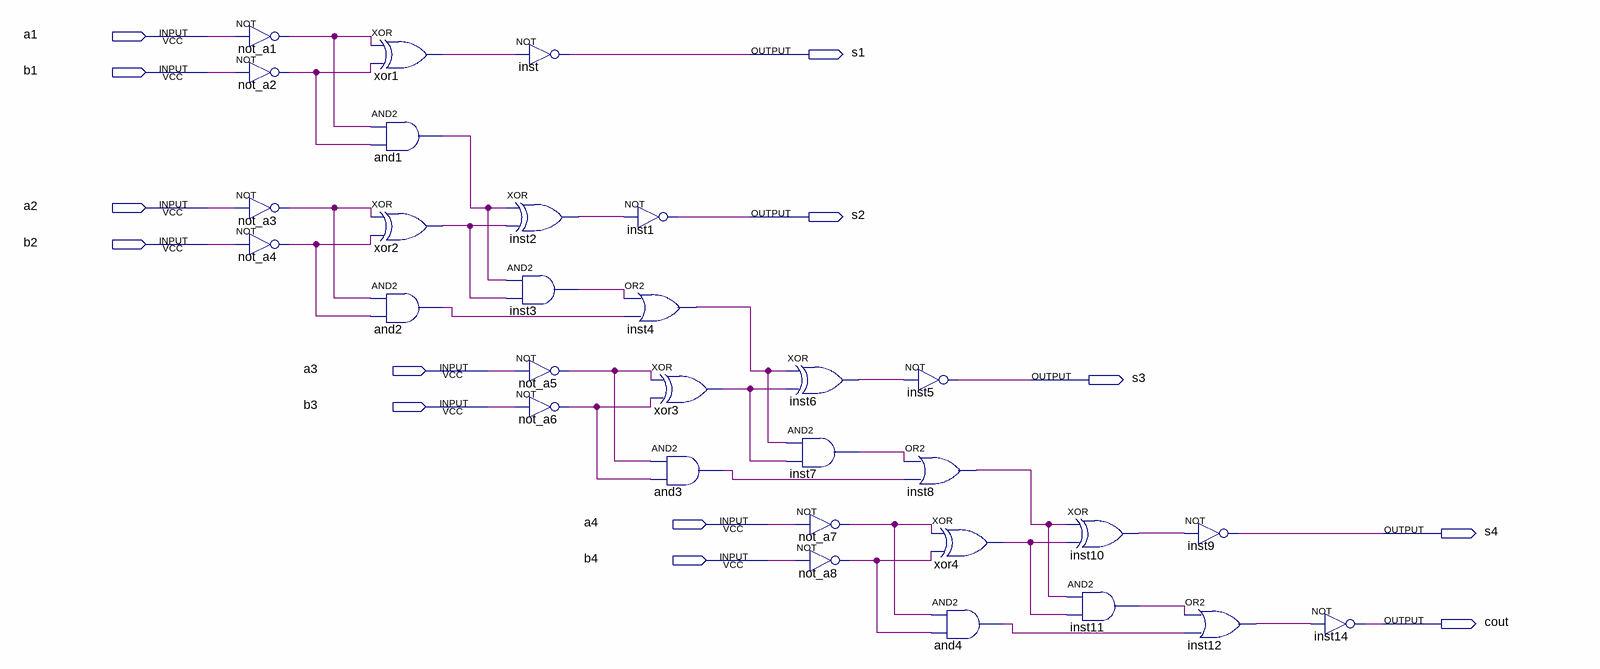
[diagram p0: schematic sheet]
// Quartus schematic lab5.bdf as structural Verilog: 30 symbols, 13 pins
module lab5 (
  input  a1,
  input  b1,
  input  a2,
  input  b2,
  input  a3,
  input  b3,
  input  a4,
  input  b4,
  output s1,
  output s2,
  output s3,
  output s4,
  output cout
);

  wire and1_out, and2_out, and3_out, and4_out, inst2_out, inst3_out, inst4_out, inst6_out, inst7_out,
       inst8_out, inst10_out, inst11_out, inst12_out, not_a1_out, not_a2_out, not_a3_out, not_a4_out,
       not_a5_out, not_a6_out, not_a7_out, not_a8_out, xor1_out, xor2_out, xor3_out, xor4_out;

  not not_a1 (not_a1_out, a1);
  not not_a2 (not_a2_out, b1);
  not not_a3 (not_a3_out, a2);
  not not_a4 (not_a4_out, b2);
  xor xor1 (xor1_out, not_a1_out, not_a2_out);
  and and1 (and1_out, not_a1_out, not_a2_out);
  xor xor2 (xor2_out, not_a3_out, not_a4_out);
  and and2 (and2_out, not_a3_out, not_a4_out);
  not inst (s1, xor1_out);
  xor inst2 (inst2_out, and1_out, xor2_out);
  and inst3 (inst3_out, and1_out, xor2_out);
  not not_a5 (not_a5_out, a3);
  not not_a6 (not_a6_out, b3);
  not inst1 (s2, inst2_out);
  or inst4 (inst4_out, inst3_out, and2_out);
  xor xor3 (xor3_out, not_a5_out, not_a6_out);
  and and3 (and3_out, not_a5_out, not_a6_out);
  xor inst6 (inst6_out, inst4_out, xor3_out);
  and inst7 (inst7_out, inst4_out, xor3_out);
  not not_a7 (not_a7_out, a4);
  not not_a8 (not_a8_out, b4);
  not inst5 (s3, inst6_out);
  or inst8 (inst8_out, inst7_out, and3_out);
  xor xor4 (xor4_out, not_a7_out, not_a8_out);
  and and4 (and4_out, not_a7_out, not_a8_out);
  xor inst10 (inst10_out, inst8_out, xor4_out);
  and inst11 (inst11_out, inst8_out, xor4_out);
  not inst9 (s4, inst10_out);
  or inst12 (inst12_out, inst11_out, and4_out);
  not inst14 (cout, inst12_out);
endmodule
